# Altium schematic sheet bms.SchDoc
size A4
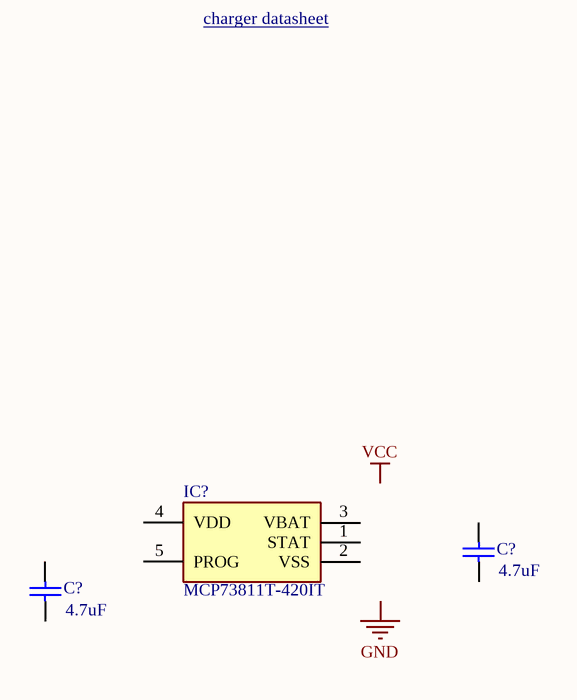
[diagram p0: bms.SchDoc]

## Parts
(Parts that share a designator on the sheet are numbered #1, #2 ... from top to bottom, then left to right.)
C?#1  value 4.7uF  [C1206]  (hidden comment: Cap Semi)
C?#2  value 4.7uF  [C1206]  (hidden comment: Cap Semi)
IC?  MCP73811T-420IT  [SOT95P270X145-5N]

## Nets

Not connected (* = marked no-connect by the designer): C?#1 1 2; C?#2 1 2; IC? 1(STAT) 2(VSS) 3(VBAT) 4(VDD) 5(PROG)

## Notes on the sheet
- charger datasheet <http://ww1.microchip.com/downloads/en/DeviceDoc/MCP73831-Family-Data-Sheet-DS20001984H.pdf>
- Labels drawn without touching a wire or pin: GND, VCC

## Library data of the parts
C?#1 C?#2 = Cap Semi: Capacitor (Semiconductor SIM Model); Published: 8-Jun-2000; LatestRevisionDate: 29-May-2009; LatestRevisionNote: IPC-7351 Footprint Added.; PackageReference: C1206; Publisher: Altium Limited; PackageDescription: Chip Capacitor
IC? = MCP73831T: Integrated Circuit; Manufacturer_Name: Microchip; Manufacturer_Part_Number: MCP73831T-5ACI/OT; Datasheet Link: http://www.microchip.com/mymicrochip/filehandler.aspx?ddocname=en025112; Height: 1.45mm; Arrow Part Number: MCP73831T-5ACI/OT; Arrow Price/Stock: https://www.arrow.com/en/products/mcp73831t-5aciot/microchip-technology; Mouser Part Number: 579-MCP73831T5ACIOT; Mouser Price/Stock: https://www.mouser.co.uk/ProductDetail/Microchip-Technology/MCP73831T-5ACI-OT?qs=hH%252BOa0VZEiAcgAcEkuamXg%3D%3D